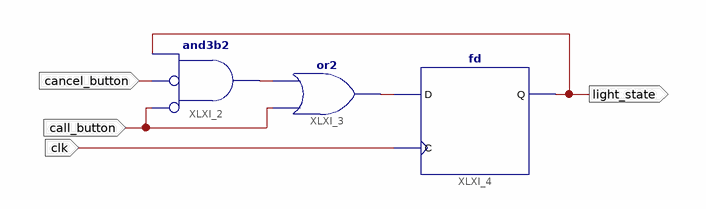
[diagram p0: schematic sheet 1]
// Xilinx ISE schematic flight_attendant_call_system_sch.sch (spartan3e) as structural Verilog: 3 symbols, 4 ports
module flight_attendant_call_system_sch (
  input  call_button,
  input  cancel_button,
  input  clk,
  output light_state
);

  wire XLXN_11, XLXN_12;

  and XLXI_2 (XLXN_11, ~call_button, ~cancel_button, light_state);  // and3b2
  fd XLXI_4 (.C(clk), .D(XLXN_12), .Q(light_state));
  or XLXI_3 (XLXN_12, call_button, XLXN_11);
endmodule
